# EasyEDA Pro project MAX31855-K-THERMOCOUPLE_METER.epro

# Schematic Schematic1
Create Date: 2024-03-21; Page Name: P1; Project Name: MAX31855-K-THERMOCOUPLE_METER; Schematic Name: Schematic1; Update Date: 2024-03-21; Company: 嘉立创EDA; Page Size: A4; Version: V1.0
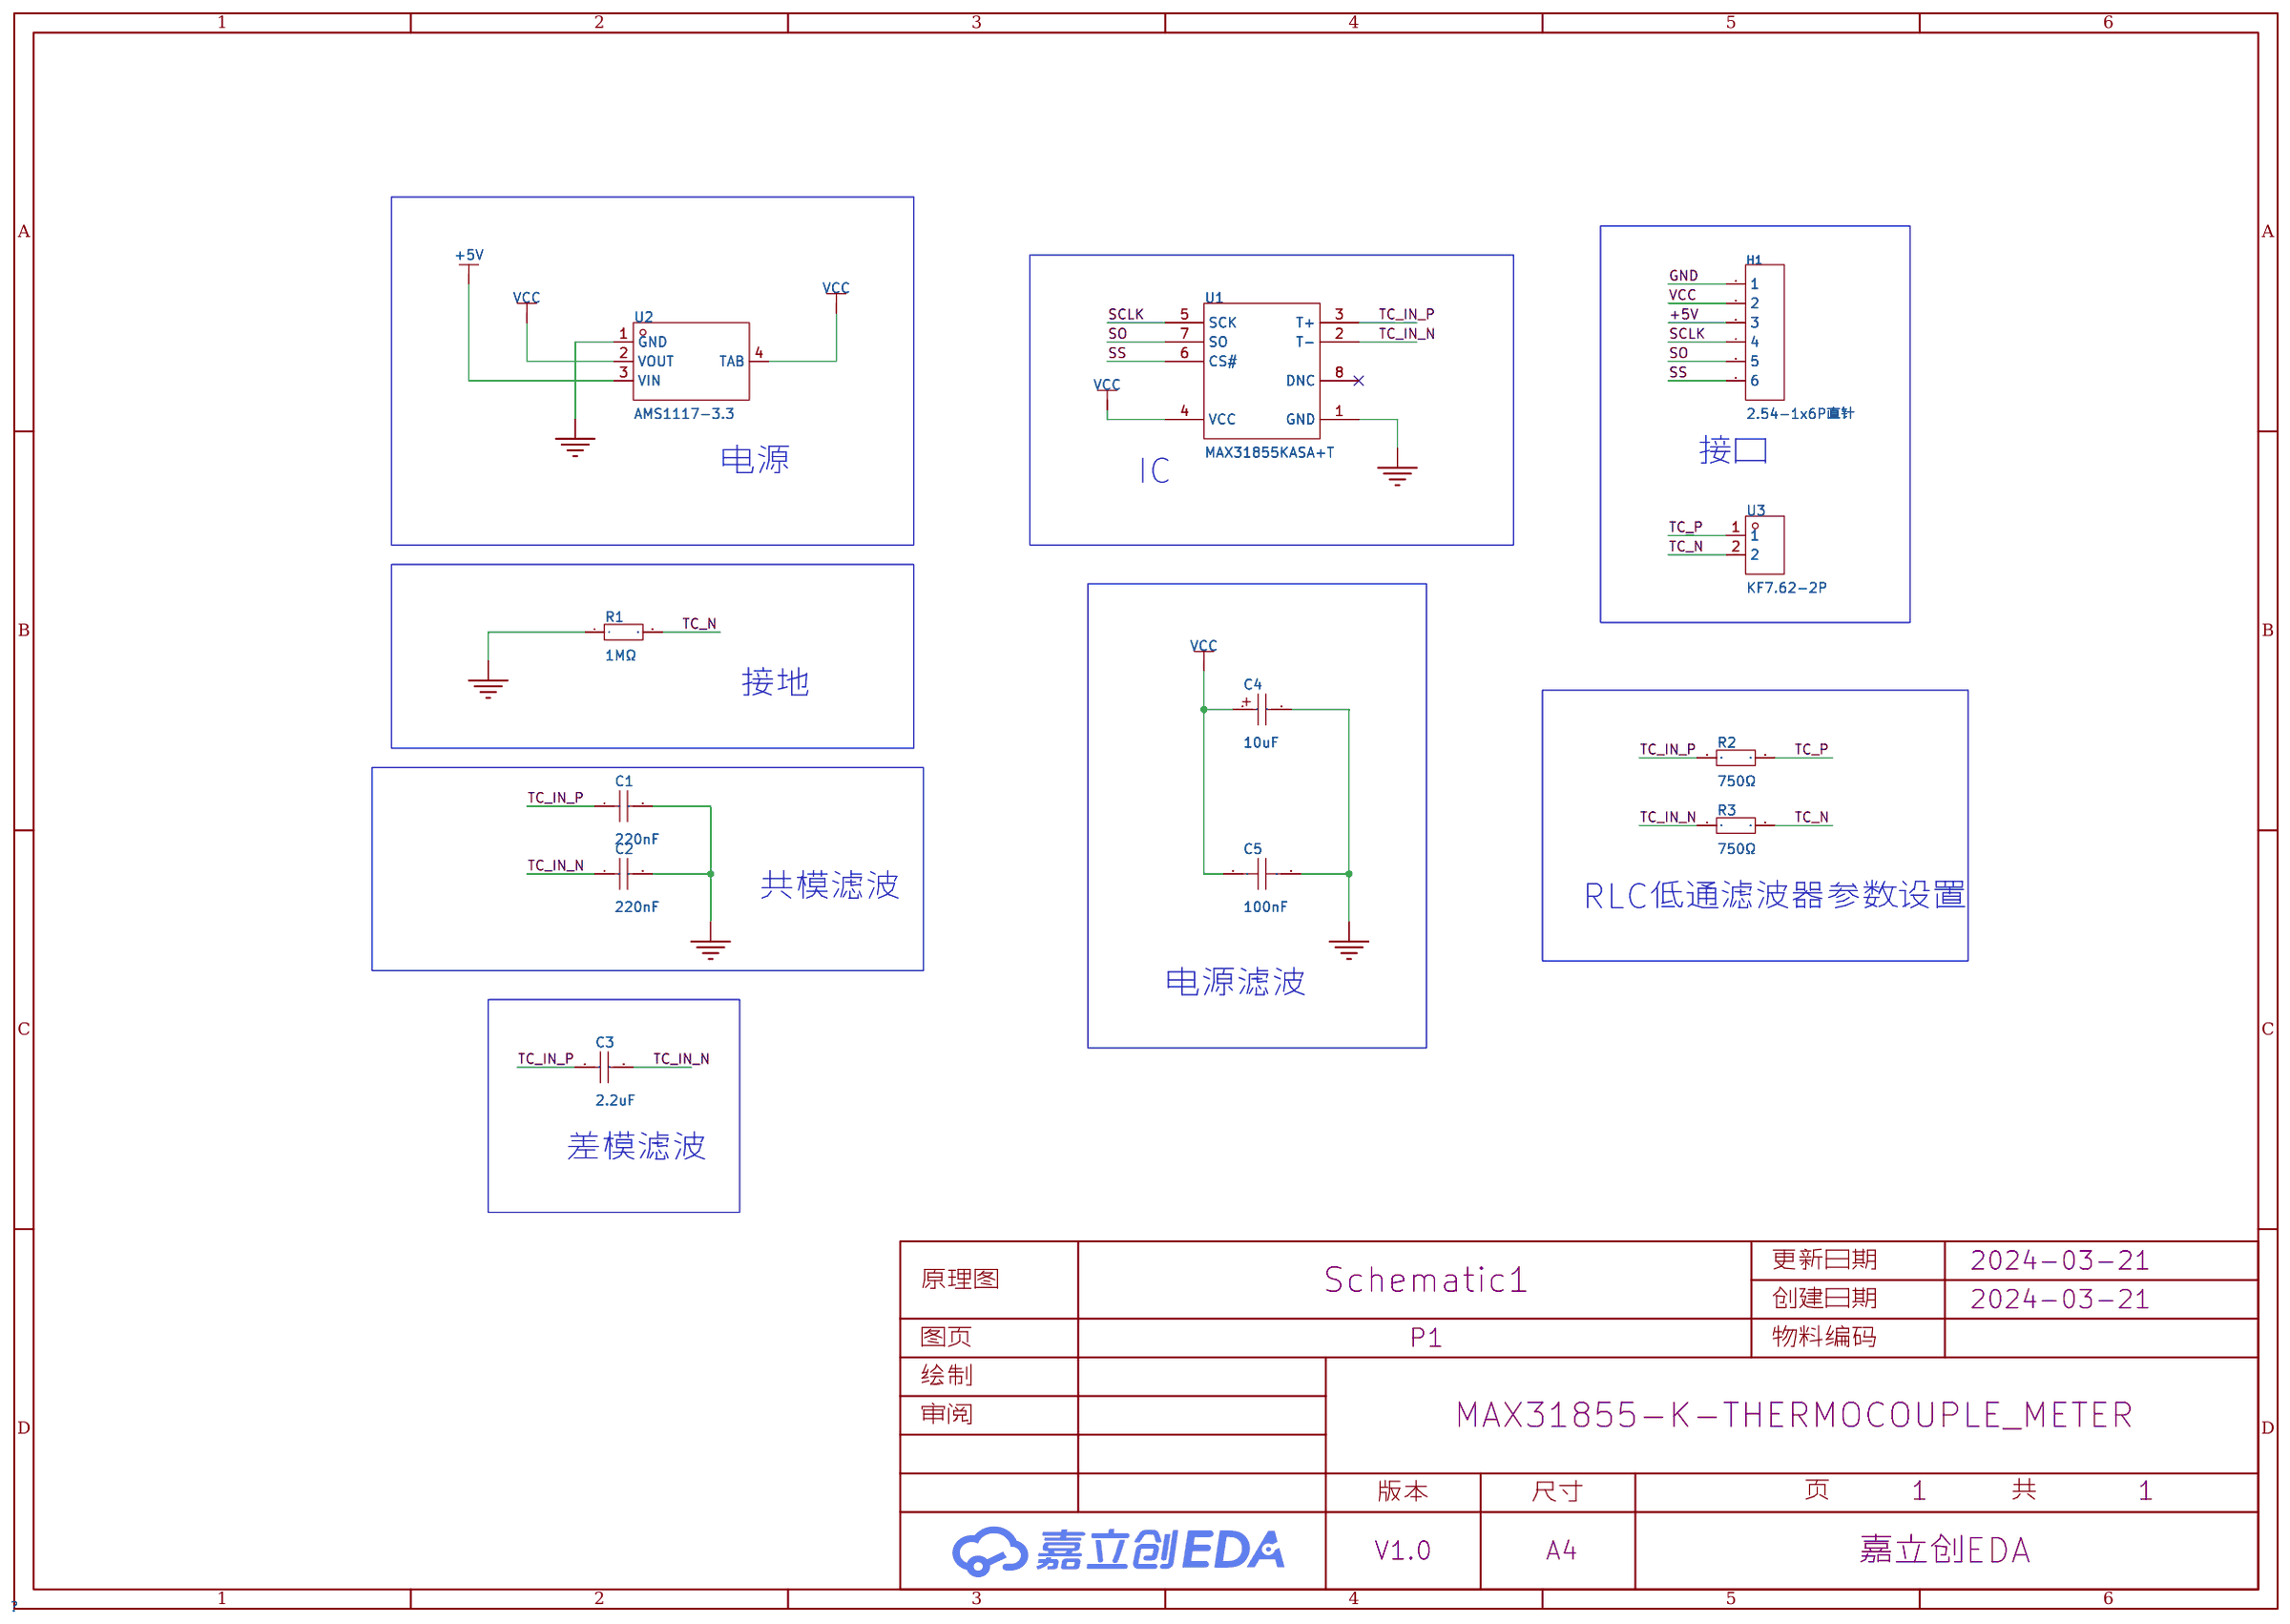
[diagram p0: schematic sheet]

## Parts
C1  220nF  [C0603]
C2  220nF  [C0603]
C3  2.2uF  [C0603]
C4  10uF  [CAP-SMD_L3.2-W1.6-RD]
C5  100nF  [C0603]
H1  2.54-1x6P直针  [HDR-TH_6P-P2.54-V-M-1]
R1  1MΩ  [R0402]
R2  750Ω  [R0603]
R3  750Ω  [R0603]
U1  MAX31855KASA+T  [SO-8_L4.9-W3.9-P1.27-LS5.9-BL]
U2  AMS1117-3.3  [SOT-223-3_L6.5-W3.5-P3.05-LS7.0]
U3  KF7.62-2P  [CONN-TH_KF7.62-2P]

## Library data of the parts
C1 C2 = CC0603KRX7R9BB224: 容值:220nF;精度:±10%;额定电压:50V;材质(温度系数):X7R;; LCSC Part Name: 220nF ±10% 50V; Supplier Part: C107083; Manufacturer: YAGEO(国巨); Supplier Footprint: 0603; JLCPCB Part Class: 扩展库; Datasheet: https://atta.szlcsc.com/upload/public/pdf/source/20180910/C282072_33301C7F631E79921B82A8DAC6BCC5B3.pdf; Supplier: LCSC; Tolerance: ±10%; Voltage Rated: 50V; Temperature Coefficient: X7R
C3 = CL10A225KO8NNNC: 容值:2.2uF;精度:±10%;额定电压:16V;材质(温度系数):X5R;; LCSC Part Name: 2.2uF ±10% 16V; Supplier Part: C23630; Manufacturer: SAMSUNG(三星); Supplier Footprint: 0603; JLCPCB Part Class: 基础库; Datasheet: https://atta.szlcsc.com/upload/public/pdf/source/20160218/1457707763339.pdf; Supplier: LCSC; Tolerance: ±10%; Voltage Rated: 16V; Temperature Coefficient: X5R
C4 = CA45-A-16V-10uF-K: 容值:10uF;精度:±10%;额定电压:16V;等效串联电阻:10Ω@100kHz;; LCSC Part Name: 10uF ±10% 16V; Supplier Part: C128254; Manufacturer: CEC(振华新云); Supplier Footprint: CASE-A-3216; JLCPCB Part Class: 扩展库; Datasheet: https://atta.szlcsc.com/upload/public/pdf/source/20170914/C128254_1505359752472967905.pdf; Supplier: LCSC; Tolerance: ±10%; Rated Voltage: 16V; Equivalent Series Resistance(ESR): 10Ω@100kHz; Operating Temperature: -55℃~+125℃
C5 = CC0603KRX7R9BB104: 容值:100nF;精度:±10%;额定电压:50V;材质(温度系数):X7R;; LCSC Part Name: 100nF ±10% 50V; Supplier Part: C14663; Manufacturer: YAGEO(国巨); Supplier Footprint: 0603; JLCPCB Part Class: 基础库; Datasheet: https://atta.szlcsc.com/upload/public/pdf/source/20180910/C282072_33301C7F631E79921B82A8DAC6BCC5B3.pdf; Supplier: LCSC; Tolerance: ±10%; Voltage Rated: 50V; Temperature Coefficient: X7R
H1 = 2.54-1x6P直针: 插针结构:1x6P;间距:2.54mm;行距:-;圆针/方针:方针;安装类型:直插;排数:单排;总PIN位数:6P;额定电流:3A;额定电压:-;配合针长度:-;塑高:-;触头材质:黄铜;触头镀层:-;工作温度范围:-40℃~+105℃;颜色:黑色;; LCSC Part Name: 间距:2.54mm 1x6P 直插 方针; Supplier Part: C37208; Manufacturer: BOOMELE(博穆精密); Supplier Footprint: 插件,P=2.54mm; JLCPCB Part Class: 扩展库; Supplier: LCSC; Pin Structure: 1x6P; Pitch: 2.54mm; Circluar Pins/Square Pins: 方针; Mounting Type: 直插; Number of Rows: 单排; Number of Pins: 6P; Current Rating (Max): 3A; Contact Material: 黄铜; Operating Temperature Range: -40℃~+105℃; Color: 黑色
R1 = 0402WGF1004TCE: 电阻类型:厚膜电阻;阻值:1MΩ;精度:±1%;功率:62.5mW;最大工作电压:50V;温度系数:±100ppm/℃;; LCSC Part Name: 1MΩ ±1% 62.5mW 厚膜电阻; Supplier Part: C26083; Manufacturer: UNI-ROYAL(厚声); Supplier Footprint: 0402; JLCPCB Part Class: 基础库; Datasheet: https://atta.szlcsc.com/upload/public/pdf/source/20200306/C422600_1E6D84923E4A46A82E41ADD87F860B5C.pdf; Supplier: LCSC; Type: 厚膜电阻; Tolerance: ±1%; Power(Watts): 62.5mW; Overload Voltage (Max): 50V; Temperature Coefficient: ±100ppm/℃; Operating Temperature Range: -55℃~+155℃
R2 R3 = 0603WAF7500T5E: 电阻类型:厚膜电阻;阻值:750Ω;精度:±1%;功率:100mW;最大工作电压:75V;温度系数:±100ppm/℃;; LCSC Part Name: 750Ω ±1% 100mW 厚膜电阻; Supplier Part: C23241; Manufacturer: UNI-ROYAL(厚声); Supplier Footprint: 0603; JLCPCB Part Class: 扩展库; Datasheet: https://atta.szlcsc.com/upload/public/pdf/source/20200306/C422600_1E6D84923E4A46A82E41ADD87F860B5C.pdf; Supplier: LCSC; Type: 厚膜电阻; Tolerance: ±1%; Power(Watts): 100mW; Overload Voltage (Max): 75V; Temperature Coefficient: ±100ppm/℃; Operating Temperature Range: -55℃~+155℃
U1 = MAX31855KASA+T: 冷端补偿热电偶至数字输出转换器、高精度热电偶数字转换器IC，有效简化设计并降低系统成本; LCSC Part Name: MAX31855KASA; Supplier Part: C52028; Manufacturer: ADI(亚德诺)/MAXIM(美信); Supplier Footprint: SO-8; JLCPCB Part Class: 扩展库; Datasheet: https://atta.szlcsc.com/upload/public/pdf/source/20200102/C476183_F86532FAEE27BC800DAB157AD9244C36.pdf; Supplier: LCSC
U2 = AMS1117-3.3_C5250992: 输出类型：固定 输出极性：正 最大输入电压：18V 输出电压：3.3V 输出电流：1A 电源纹波抑制比(PSRR)：60dB@(120Hz)。当前应用较多领域：三端稳压器，机顶盒; Supplier Part: C5250992; Manufacturer: TWGMC(台湾迪嘉); Supplier Footprint: SOT-223-3L; JLCPCB Part Class: 扩展库; Datasheet: https://atta.szlcsc.com/upload/public/pdf/source/20221109/A58A92B07670E85D28928AE371260E8D.pdf; Supplier: LCSC
U3 = KF7.62-2P: 隔板类型:两面;间距:7.62mm;结构:1x2P;安装方式:直针;引脚位置:边脚;排数:1;额定电流:24A;额定电压:450V;线规 - AWG:12~22;线规 - 平方毫米:2.5;工作温度范围:-40℃~+105℃;颜色:黑色;每排PIN数:2;; LCSC Part Name: 7.62mm 1x2P 每排P数:2 排数:1 直针 边脚 黑色; Supplier Part: C707824; Manufacturer: KEFA(科发); Supplier Footprint: 插件,P=7.62mm; JLCPCB Part Class: 扩展库; Datasheet: https://atta.szlcsc.com/upload/public/pdf/source/20230331/11104CA872B730518BFDFC9F574D6E42.pdf; Supplier: LCSC; Barrier Type: 两面; Pitch: 7.62mm; Structure: 1x2P; Mounting Style: 直针; Pin Location: 边脚; Number of Pins: 2P; Number of Rows: 1; Current Rating (Max): 24A; Voltage Rating (Max): 450V; Wire Gauge - AWG: 12~22; Wire Gauge - mm2: 2.5; Operating Temperature Range: -40℃~+105℃; Color: 黑色; Number of PINs Per Row: 2

## Nets
+5V: H1.3 U2.3(VIN)
GND: C1.2 C2.2 C4.2 C5.2 H1.1 R1.1 U1.1(GND) U2.1(GND)
VCC: C4.1 C5.1 H1.2 U1.4(VCC) U2.2(VOUT) U2.4(TAB)
SCLK: H1.4 U1.5(SCK)
SO: H1.5 U1.7(SO)
SS: H1.6 U1.6(CS#)
TC_IN_N: C2.1 C3.2 R3.1 U1.2(T-)
TC_IN_P: C1.1 C3.1 R2.1 U1.3(T+)
TC_N: R1.2 R3.2 U3.2
TC_P: R2.2 U3.1

Not connected (* = marked no-connect by the designer): U1 8(DNC)*

## Notes on the sheet
- 电源
- 接口
- IC
- 接地
- 共模滤波
- RLC低通滤波器参数设置
- 电源滤波
- 差模滤波

# Board PCB1
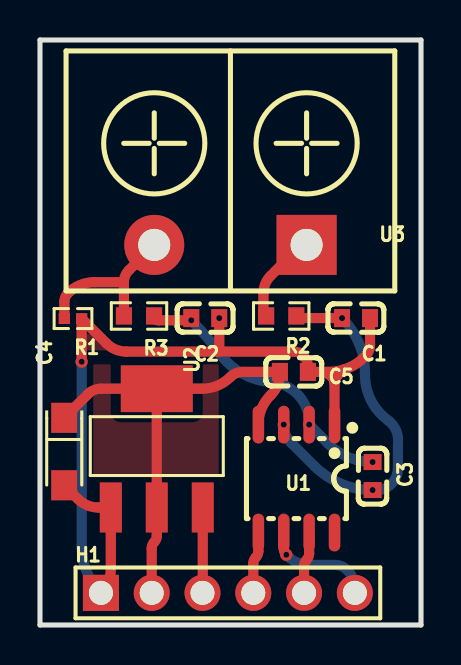
[diagram p1: board, top side]
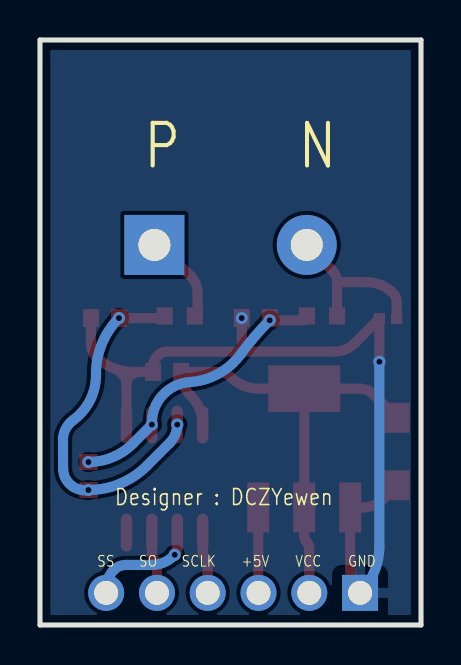
[diagram p2: board, bottom side, seen from below]

Outline 19.06 x 29.25 mm; copper layers: Top Layer, Bottom Layer. Coordinates in mm from the lower left corner of the outline.
Outline path: 0,29.25 19.06,29.25 19.06,0 0,0 0,29.25
Stack: Top Layer 0.035mm / Dielectric1 1.51mm FR4 er 4.5 / Bottom Layer 0.035mm

## Design rules (mm)
template: JLCPCB Capability(Two Layers Board)
spacing copperThickness1oz (default): track to track 0.102, other pairs 0.152 to 0.3
spacing copperThickness2oz: track to track 0.203, other pairs 0.152 to 0.3
track width copperThickness1oz (default): min 0.127, default 0.254, max 2.54
track width copperThickness2oz: min 0.203, default 0.254, max 2.54
differential pair differentialPair (default): width min 0.127, default 0.254, max 2.54; gap min 0.152, default 0.152
via viaSize (default): diameter min 0.5, default 0.61, max 10; hole min 0.3, default 0.305, max 6.3

## Placement (name value [footprint] x y rotation side)
C1  220nF  [C0603]  15.81 15.35 0 top
C2  220nF  [C0603]  8.27 15.35 0 top
C3  2.2uF  [C0603]  16.64 7.45 90 top
C4  10uF  [CAP-SMD_L3.2-W1.6-RD]  1.21 8.67 270 top
C5  100nF  [C0603]  12.7 12.66 0 top
H1  2.54-1x6P直针  [HDR-TH_6P-P2.54-V-M-1]  9.4 1.61 0 top
R1  1MΩ  [R0402]  1.65 15.32 180 top
R2  750Ω  [R0603]  12.06 15.45 180 top
R3  750Ω  [R0603]  4.95 15.45 180 top
U1  MAX31855KASA+T  [SO-8_L4.9-W3.9-P1.27-LS5.9-BL]  12.83 7.32 180 top
U2  AMS1117-3.3  [SOT-223-3_L6.5-W3.5-P3.05-LS7.0]  5.84 8.85 270 top
U3  KF7.62-2P  [CONN-TH_KF7.62-2P]  9.53 19.01 180 top

## Footprints (pads in the part's own frame, mm; a bottom-side part is the same pattern mirrored in y, then rotated)
C0603
  rect 0.8x0.9 smd: 1(-0.7,0) 2(0.7,0)
CAP-SMD_L3.2-W1.6-RD
  rect 1.5x1.296 smd: 1(-1.687,0) 2(1.687,0)
CONN-TH_KF7.62-2P
  rect 3x3 hole 1.6: 1(-3.81,0)
  round 3 hole 1.6: 2(3.81,0)
HDR-TH_6P-P2.54-V-M-1
  rect 1.8x1.8 hole 1.2: 1(-6.35,0)
  round 1.8 hole 1.2: 2(-3.81,0) 3(-1.27,0) 4(1.27,0) 5(3.81,0) 6(6.35,0)
R0402
  rect 0.566x0.54 smd: 1(-0.433,0) 2(0.433,0)
R0603
  rect 0.806x0.864 smd: 1(-0.753,0) 2(0.753,0)
SO-8_L4.9-W3.9-P1.27-LS5.9-BL
  oval 0.574x1.888 smd: 1(-1.905,-2.699) 2(-0.635,-2.699) 3(0.635,-2.699) 4(1.905,-2.699) 5(1.905,2.699) 6(0.635,2.699) 7(-0.635,2.699) 8(-1.905,2.699)
SOT-223-3_L6.5-W3.5-P3.05-LS7.0
  rect 2.5x1.1 smd: 1(2.97,-2.3) 2(2.97,0) 3(2.97,2.3)
  rect 2.34x3.6 smd: 4(-2.97,0)

## Nets
As in the schematic.

Pads without a net: U1 8

## Via types
v1: diameter 0.61, hole 0.305, Top Layer to Bottom Layer, 9 vias

## Routing (per net, layer and track width the routed paths; a pad name or vN(x,y) marks a point on that pad's centre or on a via; arc(x,y) is an arc through that point)
+5V: length 4.3
  Top Layer w0.508: U2.3 8.14,1.64 arc(8.14,1.62) H1.3
GND: length 44.4
  Top Layer w0.508: C4.2 1.9,6.3 arc(2.37,5.99) 2.92,5.88 U2.1 3.54,2.8 arc(3.41,2.15) H1.1 ; 8.9,13.67 12.7,13.67 arc(12.93,13.63) 13.13,13.49 13.21,13.42 arc(13.35,13.21) 13.4,12.95 C5.2 13.99,12.66 ; 8.9,13.67 4.32,13.67 arc(3.78,13.78) 3.32,14.08 R1.1 v1(2.08,13.16) ; 8.9,13.67 arc(8.95,13.74) 8.97,13.83 v1(8.97,15.35) ; 14.73,12.1 U1.1 ; 14.73,12.1 arc(14.77,12.31) 14.9,12.49 15.18,12.77 ; 14.73,12.1 arc(14.7,12.26) 14.6,12.4 arc(14.32,12.59) 13.99,12.66 ; 13.99,12.66 14.42,12.66 arc(14.8,12.68) 15.18,12.77 ; C1.2 16.51,14.03 arc(16.44,13.7) 16.26,13.42 arc(15.76,13.03) 15.18,12.77
  Bottom Layer w0.508: v1(2.08,13.16) 2.08,3.93 arc(2.33,2.67) H1.1
VCC: length 24.8
  Top Layer w0.508: C4.1 2.4,11.55 arc(2.7,11.75) 3.05,11.82 U2.4 ; U2.4 8.11,11.82 arc(8.88,11.97) 9.53,12.4 arc(9.81,12.59) 10.14,12.66 C5.1 12,12.58 arc(11.88,12) 11.56,11.51 11.53,11.48 arc(11.08,10.81) U1.4 ; U2.4 U2.2 5.84,4.45 arc(5.81,4.29) 5.72,4.15 arc(5.62,4.01) 5.59,3.84 H1.2
SCLK: length 3.1
  Top Layer w0.508: H1.4 10.67,3.08 arc(10.7,3.24) 10.79,3.39 arc(10.89,3.53) 10.92,3.69 U1.5
SO: length 3.1
  Top Layer w0.508: H1.5 13.21,2.95 arc(13.24,3.12) 13.34,3.26 arc(13.43,3.4) 13.46,3.56 U1.7
SS: length 5.7
  Top Layer w0.508: U1.6 12.19,3.82 arc(12.22,3.65) v1(12.32,3.51)
  Bottom Layer w0.508: v1(12.32,3.51) 12.38,3.45 arc(12.88,3.12) 13.46,3 14.75,3 arc(15.09,2.94) 15.37,2.75 arc(15.65,2.33) 15.75,1.83 H1.6
TC_IN_N: length 14.1
  Top Layer w0.508: v1(7.57,15.24) 5.91,15.24 arc(5.8,15.26) 5.71,15.32
  Bottom Layer w0.508: v1(7.57,15.24) arc(8.32,14.42) 9.02,13.55 arc(10.13,12.57) 11.56,12.15 arc(12.94,11.47) v1(13.46,10.02) 14.41,9.07 arc(15.43,8.39) v1(16.64,8.15)
TC_IN_P: length 18.4
  Top Layer w0.508: v1(15.11,15.35) 12.88,15.35 arc(12.85,15.34) 12.82,15.32
  Bottom Layer w0.508: v1(15.11,15.35) arc(15.97,14.05) 16.26,12.53 arc(16.55,11.25) 17.4,10.24 arc(17.75,9.85) 17.91,9.35 arc(17.91,8.59) 17.9,7.83 arc(17.52,7) v1(16.64,6.75) arc(15.05,7.06) 13.71,7.96 12.57,9.1 arc(12.29,9.52) v1(12.19,10.02)
TC_N: length 8.6
  Top Layer w0.508: R1.2 1.22,16.16 arc(1.26,16.4) 1.4,16.59 arc(2.01,17) 2.73,17.14 4.2,17.14 ; 4.2,17.14 4.2,15.32 ; 4.2,17.14 arc(4.26,17.46) 4.44,17.74 5.41,18.7 arc(5.54,18.9) 5.59,19.13
TC_P: length 4.6
  Top Layer w0.508: 13.21,19.13 11.53,17.46 arc(11.27,17.06) 11.18,16.59 11.18,15.65 arc(11.21,15.47) 11.31,15.32

## Copper pours and planes (outline as drawn; the poured copper is in the pictures)
GND on Bottom Layer: 0.51,28.79 18.54,28.79 18.54,0.34 0.51,0.34
VCC on Top Layer: 2.67,13.04 8.95,13.04 8.95,7.47 2.67,7.47
GND on Top Layer: 3.51,13.9 3.69,13.78 3.91,13.73 2.17,13.73 2.12,13.74 2.08,13.77 2.08,15.32

## Text on the board
Bottom Silkscreen Layer: GND | VCC | +5V | SCLK | SO | SS | Designer : DCZYewen | N | P
